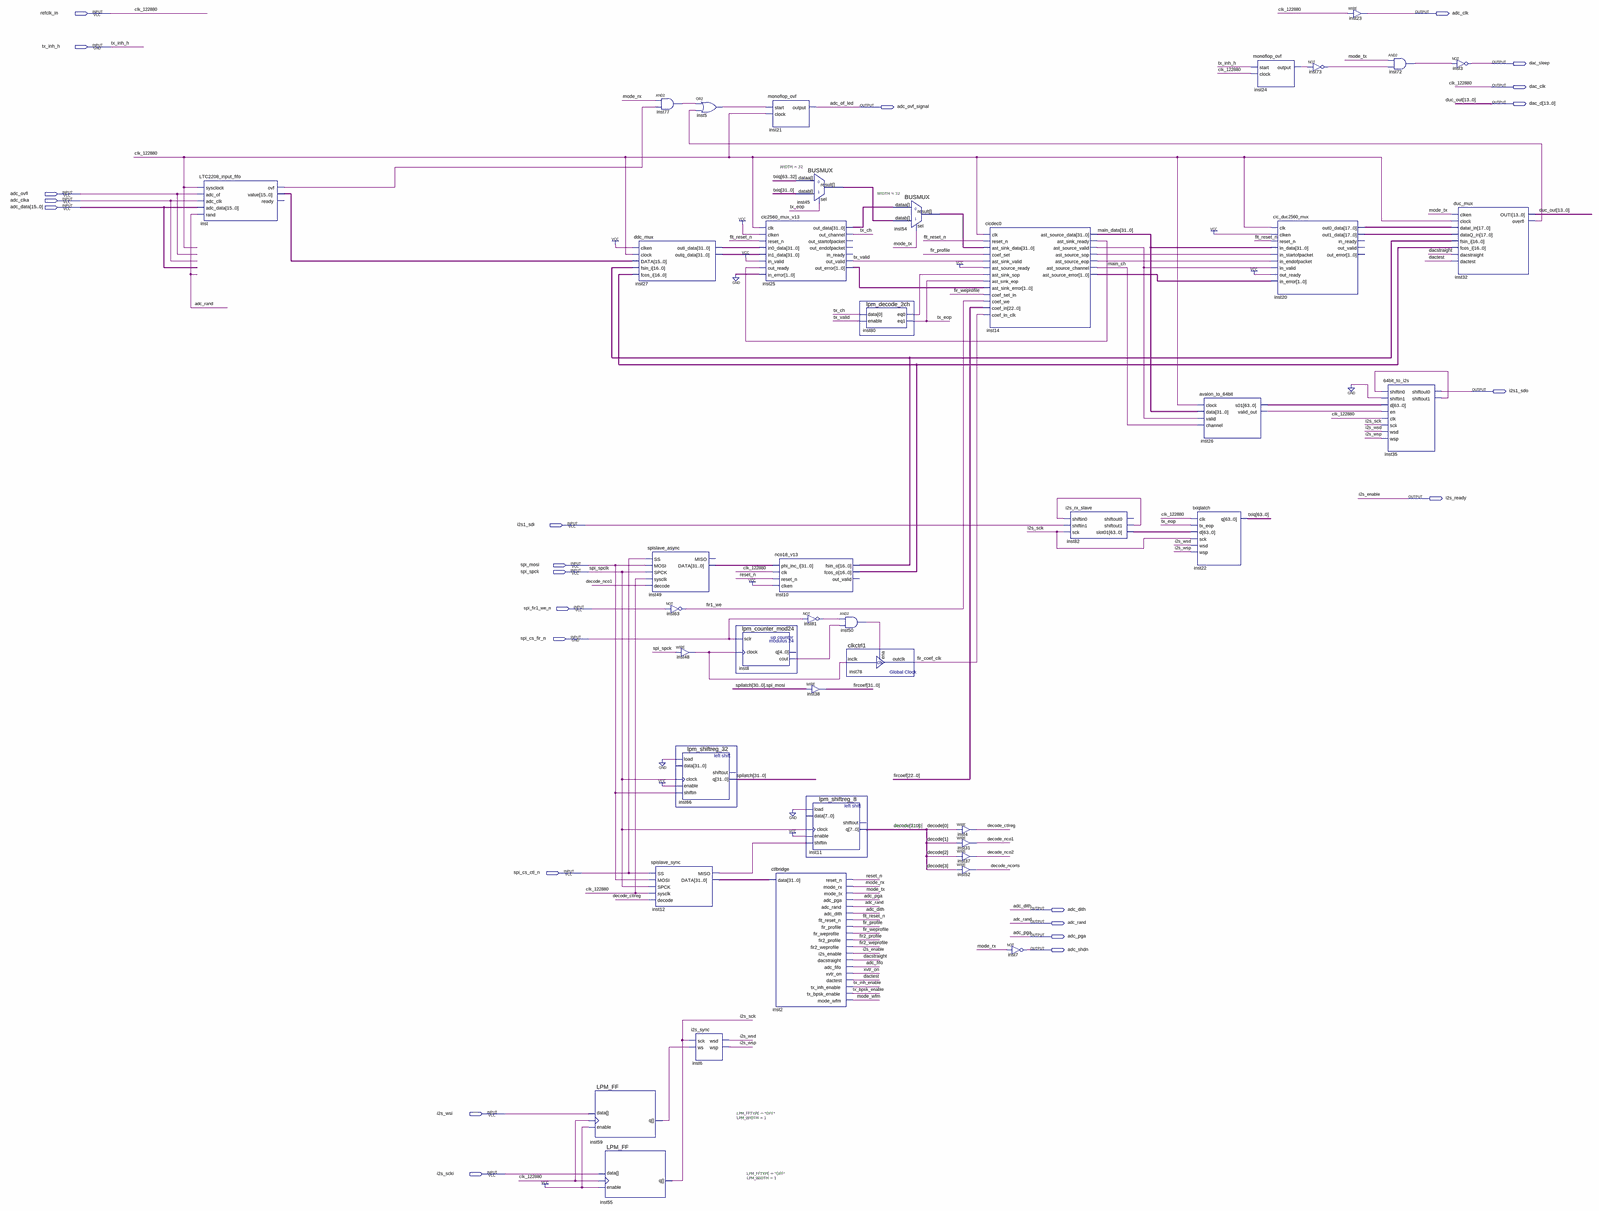
[diagram p0: schematic sheet, whole]
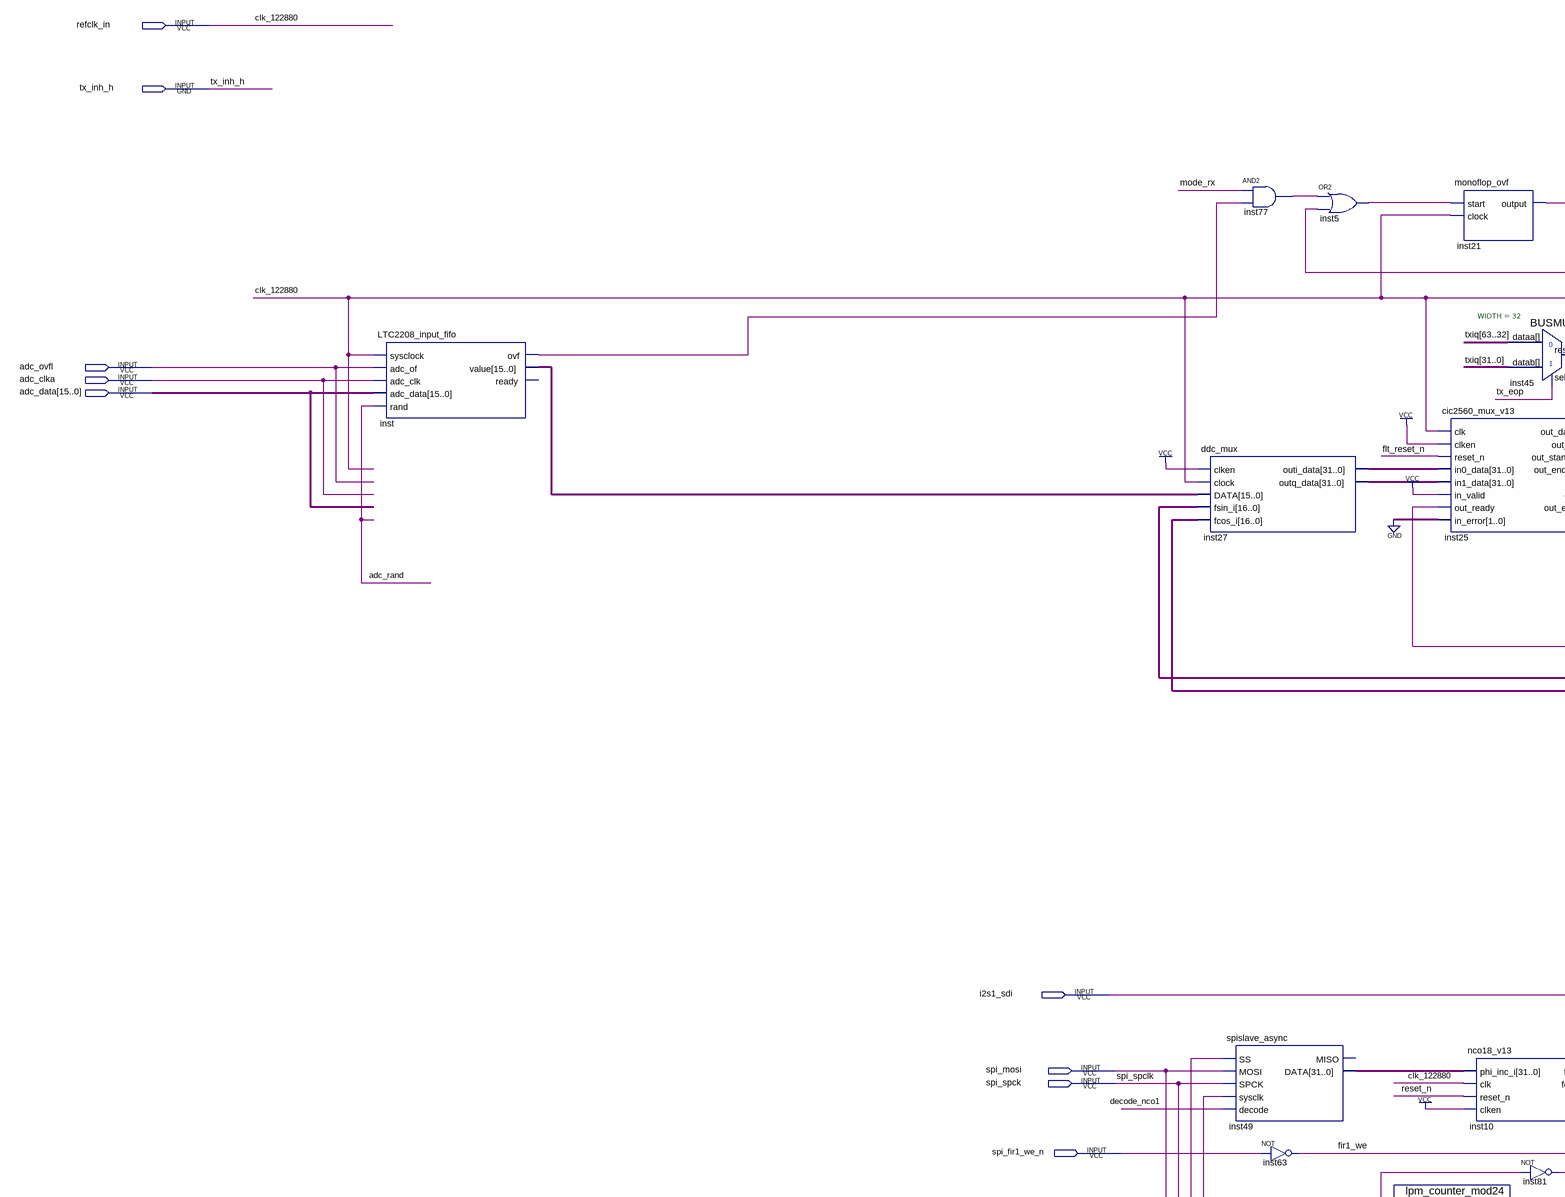
[diagram p1: schematic sheet, upper left part]
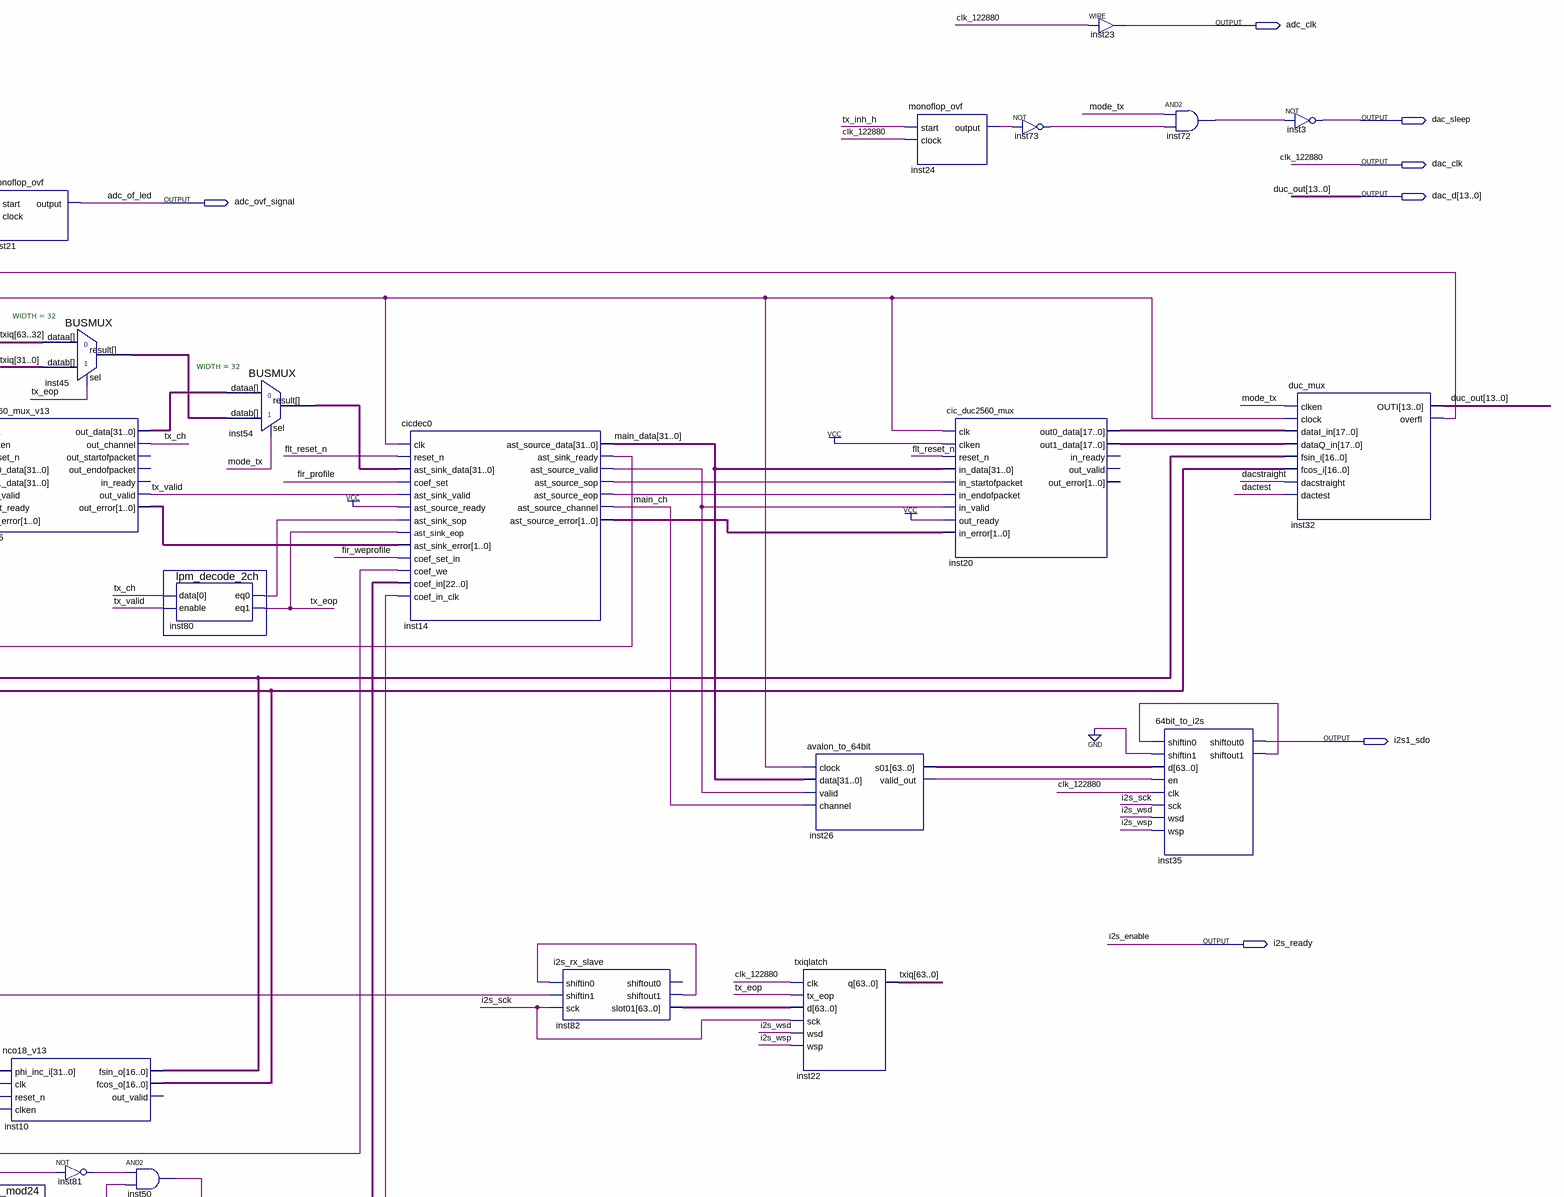
[diagram p2: schematic sheet, upper right part]
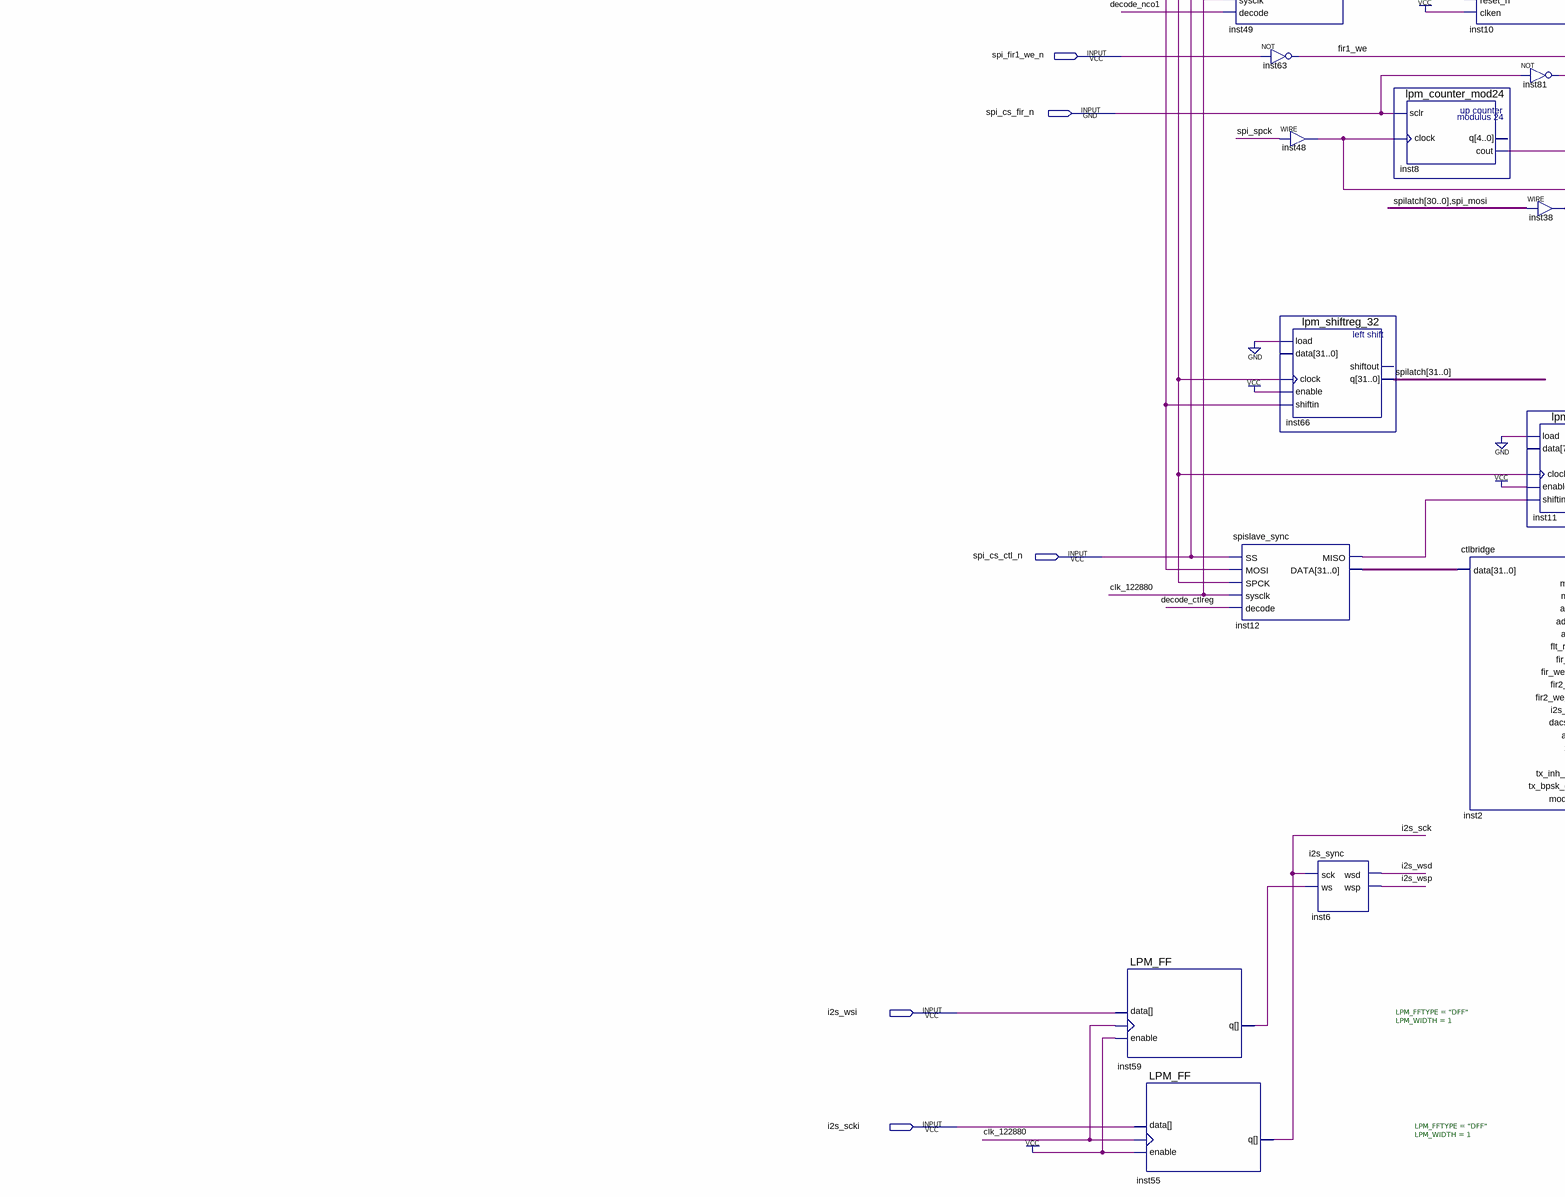
[diagram p3: schematic sheet, lower left part]
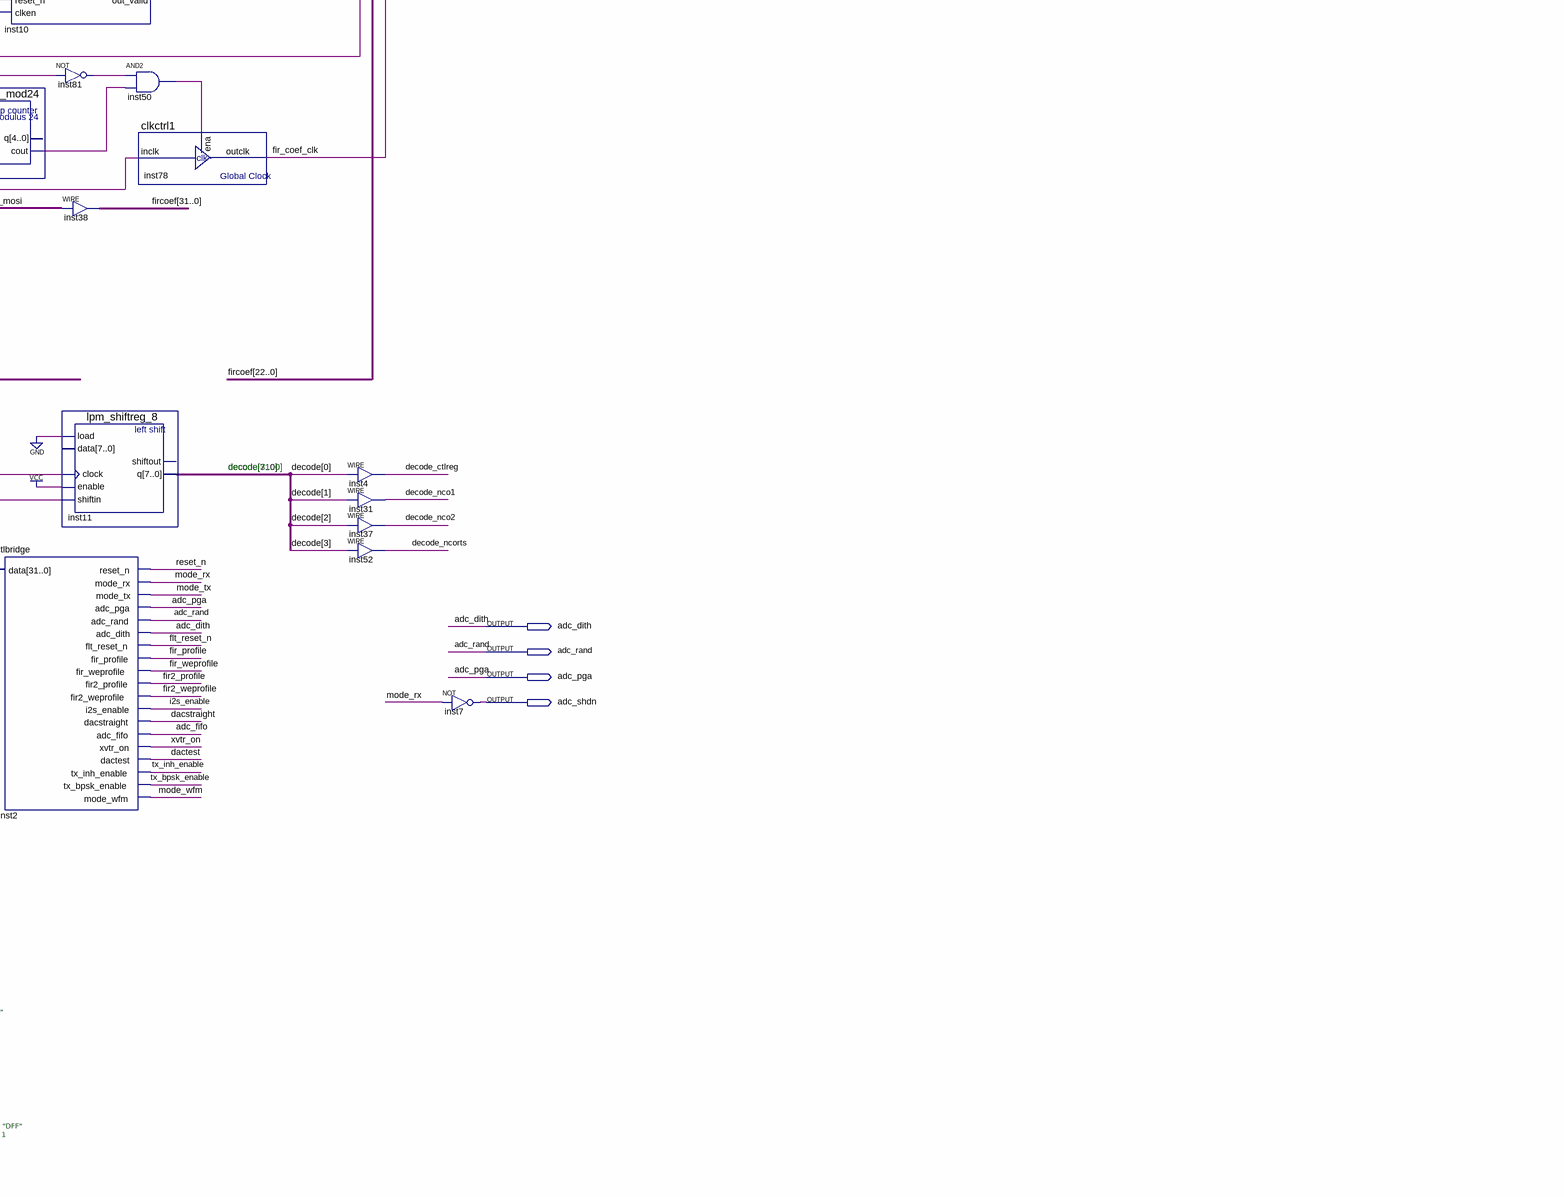
[diagram p4: schematic sheet, lower right part]
// Quartus schematic t1_1ch.bdf as structural Verilog: 42 symbols, 24 pins
module t1_1ch (
  input  refclk_in,
  input  tx_inh_h,
  input  adc_ovfl,
  input  adc_clka,
  input  [15:0] adc_data,
  input  i2s1_sdi,
  input  spi_mosi,
  input  spi_spck,
  input  spi_fir1_we_n,
  input  spi_cs_fir_n,
  input  spi_cs_ctl_n,
  input  i2s_wsi,
  input  i2s_scki,
  output adc_clk,
  output dac_sleep,
  output dac_clk,
  output [13:0] dac_d,
  output adc_ovf_signal,
  output i2s1_sdo,
  output i2s_ready,
  output adc_dith,
  output adc_rand,
  output adc_pga,
  output adc_shdn
);

  wire adc_fifo, dacstraight, dactest, decode_ctlreg, decode_nco1, decode_nco2, decode_ncorts, fir1_we,
       fir2_profile, fir2_weprofile, fir_coef_clk, fir_profile, fir_weprofile, flt_reset_n, i2s_sck, i2s_wsd,
       i2s_wsp, inst5_out, inst8_cout, inst12_miso, inst14_ast_sink_ready, inst14_ast_source_eop,
       inst14_ast_source_sop, inst14_ast_source_valid, inst24_output, inst26_valid_out, inst32_overfl,
       inst35_shiftout1, inst48_out, inst50_out, inst59_q, inst72_out, inst73_out, inst77_out, inst80_eq0,
       inst81_out, inst82_shiftout1, inst_ovf, main_ch, mode_rx, mode_tx, mode_wfm, reset_n, tx_bpsk_enable,
       tx_ch, tx_eop, tx_inh_enable, tx_valid, xvtr_on;
  wire [1:0] inst14_ast_source_error, inst25_out_error;
  wire [7:0] decode;
  wire [15:0] inst_value;
  wire [16:0] inst10_fcos_o, inst10_fsin_o;
  wire [17:0] inst20_out0_data, inst20_out1_data;
  wire [31:0] fircoef, inst12_data, inst25_out_data, inst27_outi_data, inst27_outq_data, inst45_result,
       inst49_data, inst54_result, main_data, spilatch;
  wire [63:0] inst26_s01, inst82_slot01, txiq;

  LTC2208_input_fifo inst (
    .sysclock(refclk_in), .adc_of(adc_ovfl), .adc_clk(adc_clka), .adc_data(adc_data), .\rand (adc_rand),
    .ovf(inst_ovf), .value(inst_value));  // open: ready
  LPM_FF #(.LPM_FFTYPE("DFF"), .LPM_WIDTH(1)) inst59 (.clock(refclk_in), .data(i2s_wsi), .enable(1'b1), .q(inst59_q));
  LPM_FF #(.LPM_FFTYPE("DFF"), .LPM_WIDTH(1)) inst55 (.clock(refclk_in), .data(i2s_scki), .enable(1'b1), .q(i2s_sck));
  ddc_mux inst27 (
    .clken(1'b1), .clock(refclk_in), .DATA(inst_value), .fsin_i(inst10_fsin_o), .fcos_i(inst10_fcos_o),
    .outi_data(inst27_outi_data), .outq_data(inst27_outq_data));
  and inst77 (inst77_out, mode_rx, inst_ovf);
  spislave_async inst49 (
    .SS(spi_cs_ctl_n), .MOSI(spi_mosi), .SPCK(spi_spck), .sysclk(refclk_in), .decode(decode_nco1),
    .DATA(inst49_data));  // open: MISO
  spislave_sync inst12 (
    .MOSI(spi_mosi), .SPCK(spi_spck), .SS(spi_cs_ctl_n), .decode(decode_ctlreg), .sysclk(refclk_in),
    .DATA(inst12_data), .MISO(inst12_miso));
  not inst63 (fir1_we, spi_fir1_we_n);
  assign inst48_out = spi_spck;  // WIRE inst48
  lpm_shiftreg_32 inst66 (
    .load(1'b0), .clock(spi_spck), .enable(1'b1), .shiftin(spi_mosi), .q(spilatch));  // open: data, shiftout
  or inst5 (inst5_out, inst77_out, inst32_overfl);
  i2s_sync inst6 (.sck(i2s_sck), .ws(inst59_q), .wsd(i2s_wsd), .wsp(i2s_wsp));
  lpm_counter_mod24 inst8 (.sclr(spi_cs_fir_n), .clock(inst48_out), .cout(inst8_cout));  // open: q
  monoflop_ovf inst21 (.start(inst5_out), .clock(refclk_in), .\output (adc_ovf_signal));
  cic2560_mux_v13 inst25 (
    .clk(refclk_in), .clken(1'b1), .reset_n(flt_reset_n), .in0_data(inst27_outi_data),
    .in1_data(inst27_outq_data), .in_valid(1'b1), .out_ready(inst14_ast_sink_ready), .in_error(2'b00),
    .out_data(inst25_out_data), .out_channel(tx_ch), .out_valid(tx_valid), .out_error(inst25_out_error));  // open: out_startofpacket, out_endofpacket, in_ready
  nco18_v13 inst10 (
    .phi_inc_i(inst49_data), .clk(refclk_in), .reset_n(reset_n), .clken(1'b1), .fsin_o(inst10_fsin_o),
    .fcos_o(inst10_fcos_o));  // open: out_valid
  ctlbridge inst2 (
    .data(inst12_data), .reset_n(reset_n), .mode_rx(mode_rx), .mode_tx(mode_tx), .adc_pga(adc_pga),
    .adc_rand(adc_rand), .adc_dith(adc_dith), .flt_reset_n(flt_reset_n), .fir_profile(fir_profile),
    .fir_weprofile(fir_weprofile), .fir2_profile(fir2_profile), .fir2_weprofile(fir2_weprofile),
    .i2s_enable(i2s_ready), .dacstraight(dacstraight), .adc_fifo(adc_fifo), .xvtr_on(xvtr_on),
    .dactest(dactest), .tx_inh_enable(tx_inh_enable), .tx_bpsk_enable(tx_bpsk_enable), .mode_wfm(mode_wfm));
  BUSMUX #(.WIDTH(32)) inst45 (.datab(txiq[31:0]), .sel(tx_eop), .dataa(txiq[63:32]), .result(inst45_result));
  not inst81 (inst81_out, spi_cs_fir_n);
  assign fircoef = {spilatch[30:0], spi_mosi};  // WIRE inst38
  lpm_shiftreg_8 inst11 (
    .load(1'b0), .clock(spi_spck), .enable(1'b1), .shiftin(inst12_miso), .q(decode));  // open: data, shiftout
  and inst50 (inst50_out, inst81_out, inst8_cout);
  clkctrl1 inst78 (.inclk(inst48_out), .ena(inst50_out), .outclk(fir_coef_clk));
  lpm_decode_2ch inst80 (.data(tx_ch), .enable(tx_valid), .eq0(inst80_eq0), .eq1(tx_eop));
  BUSMUX #(.WIDTH(32)) inst54 (.datab(inst45_result), .sel(mode_tx), .dataa(inst25_out_data), .result(inst54_result));
  assign decode_ctlreg = decode[0];  // WIRE inst4
  assign decode_nco1 = decode[1];  // WIRE inst31
  assign decode_nco2 = decode[2];  // WIRE inst37
  assign decode_ncorts = decode[3];  // WIRE inst52
  cicdec0 inst14 (
    .clk(refclk_in), .reset_n(flt_reset_n), .ast_sink_data(inst54_result), .coef_set(fir_profile),
    .ast_sink_valid(tx_valid), .ast_source_ready(1'b1), .ast_sink_sop(inst80_eq0), .ast_sink_eop(tx_eop),
    .ast_sink_error(inst25_out_error), .coef_set_in(fir_weprofile), .coef_we(fir1_we),
    .coef_in(fircoef[22:0]), .coef_in_clk(fir_coef_clk), .ast_source_data(main_data),
    .ast_sink_ready(inst14_ast_sink_ready), .ast_source_valid(inst14_ast_source_valid),
    .ast_source_sop(inst14_ast_source_sop), .ast_source_eop(inst14_ast_source_eop),
    .ast_source_channel(main_ch), .ast_source_error(inst14_ast_source_error));
  not inst7 (adc_shdn, mode_rx);
  i2s_rx_slave inst82 (
    .shiftin0(inst82_shiftout1), .shiftin1(i2s1_sdi), .sck(i2s_sck), .shiftout1(inst82_shiftout1),
    .slot01(inst82_slot01));  // open: shiftout0
  txiqlatch inst22 (
    .clk(refclk_in), .tx_eop(tx_eop), .d(inst82_slot01), .sck(i2s_sck), .wsd(i2s_wsd), .wsp(i2s_wsp), .q(txiq));
  avalon_to_64bit inst26 (
    .clock(refclk_in), .data(main_data), .valid(inst14_ast_source_valid), .channel(main_ch),
    .s01(inst26_s01), .valid_out(inst26_valid_out));
  monoflop_ovf inst24 (.start(tx_inh_h), .clock(refclk_in), .\output (inst24_output));
  cic_duc2560_mux inst20 (
    .clk(refclk_in), .clken(1'b1), .reset_n(flt_reset_n), .in_data(main_data),
    .in_startofpacket(inst14_ast_source_sop), .in_endofpacket(inst14_ast_source_eop),
    .in_valid(inst14_ast_source_valid), .out_ready(1'b1), .in_error(inst14_ast_source_error),
    .out0_data(inst20_out0_data), .out1_data(inst20_out1_data));  // open: in_ready, out_valid, out_error
  not inst73 (inst73_out, inst24_output);
  assign adc_clk = refclk_in;  // WIRE inst23
  \64bit_to_i2s  inst35 (
    .shiftin0(inst35_shiftout1), .shiftin1(1'b0), .d(inst26_s01), .en(inst26_valid_out), .clk(refclk_in),
    .sck(i2s_sck), .wsd(i2s_wsd), .wsp(i2s_wsp), .shiftout0(i2s1_sdo), .shiftout1(inst35_shiftout1));
  and inst72 (inst72_out, mode_tx, inst73_out);
  not inst3 (dac_sleep, inst72_out);
  duc_mux inst32 (
    .clken(mode_tx), .clock(refclk_in), .dataI_in(inst20_out0_data), .dataQ_in(inst20_out1_data),
    .fsin_i(inst10_fsin_o), .fcos_i(inst10_fcos_o), .dacstraight(dacstraight), .dactest(dactest),
    .OUTI(dac_d), .overfl(inst32_overfl));

  assign dac_clk = refclk_in;

  // Other names for the same wires on the sheet: adc_of_led = adc_ovf_signal; clk_122880 = refclk_in;
  //   duc_out[13:0] = dac_d; i2s_enable = i2s_ready; spi_spclk = spi_spck

  // Notes on the sheet:
  //   decode[31..0]
endmodule
